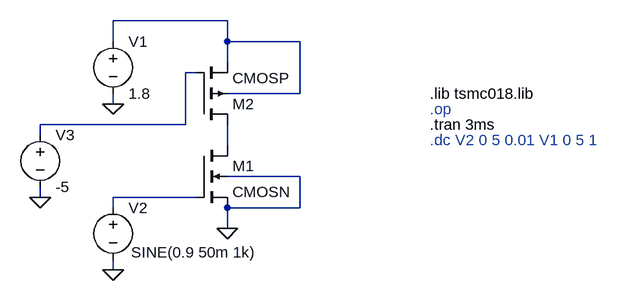
[diagram p0: schematic Draft1.asc]
Draft1.asc, the LTspice schematic file:
Version 4
SHEET 1 880 680
WIRE 272 -48 96 -48
WIRE 96 -16 96 -48
WIRE 272 -16 272 -48
WIRE 384 -16 272 -16
WIRE 272 16 272 -16
WIRE 224 32 208 32
WIRE 384 64 384 -16
WIRE 384 64 272 64
WIRE 96 80 96 64
WIRE 208 112 208 32
WIRE 208 112 -16 112
WIRE -16 128 -16 112
WIRE 272 144 272 112
WIRE 384 192 272 192
WIRE -16 224 -16 208
WIRE 224 224 96 224
WIRE 96 240 96 224
WIRE 384 240 384 192
WIRE 384 240 272 240
WIRE 272 272 272 240
WIRE 96 336 96 320
FLAG 96 80 0
FLAG -16 224 0
FLAG 96 336 0
FLAG 272 272 0
SYMBOL nmos4 224 144 R0
SYMATTR InstName M1
SYMATTR Value CMOSN
SYMATTR Value2 l=600n w=592n
SYMBOL pmos4 224 112 M180
SYMATTR InstName M2
SYMATTR Value CMOSP
SYMATTR Value2 l=2u w=0.2u
SYMBOL voltage 96 -32 R0
WINDOW 123 0 0 Left 0
WINDOW 39 0 0 Left 0
SYMATTR InstName V1
SYMATTR Value 1.8
SYMBOL voltage 96 224 R0
WINDOW 3 28 85 Left 2
WINDOW 123 24 124 Left 2
WINDOW 39 0 0 Left 0
SYMATTR Value SINE(0.9 50m 1k)
SYMATTR InstName V2
SYMBOL voltage -16 112 R0
WINDOW 123 0 0 Left 0
WINDOW 39 0 0 Left 0
SYMATTR InstName V3
SYMATTR Value -5
TEXT 584 64 Left 2 !.lib tsmc018.lib
TEXT 584 88 Left 2 ;.op
TEXT 584 112 Left 2 !.tran 3ms
TEXT 584 136 Left 2 ;.dc V2 0 5 0.01 V1 0 5 1

The netlist it stands for:
* Draft1.asc
M1 N003 N004 0 0 CMOSN l=600n w=592n
M2 N003 N002 N001 N001 CMOSP l=2u w=0.2u
V1 N001 0 1.8
V2 N004 0 SINE(0.9 50m 1k)
V3 N002 0 -5
.model NMOS NMOS
.model PMOS PMOS
.lib standard.mos
.lib tsmc018.lib
* .op
.tran 3ms
* .dc V2 0 5 0.01 V1 0 5 1
.backanno
.end